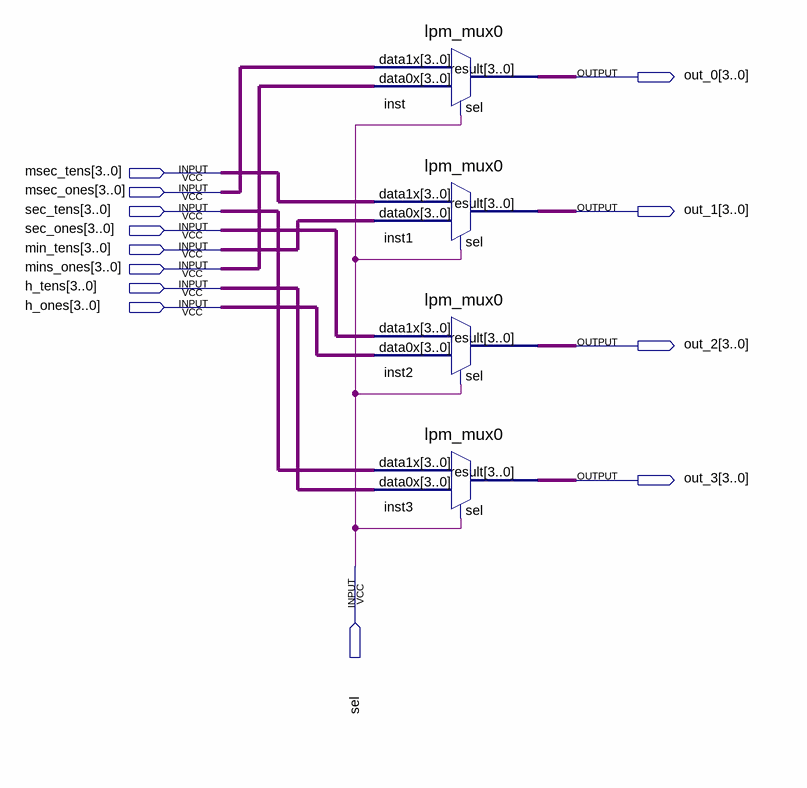
[diagram p0: schematic sheet]
// Quartus schematic time_selector.bdf as structural Verilog: 4 symbols, 13 pins
module time_selector (
  input  [3:0] msec_tens,
  input  [3:0] msec_ones,
  input  [3:0] sec_tens,
  input  [3:0] sec_ones,
  input  [3:0] min_tens,
  input  [3:0] mins_ones,
  input  [3:0] h_tens,
  input  [3:0] h_ones,
  input  sel,
  output [3:0] out_0,
  output [3:0] out_1,
  output [3:0] out_2,
  output [3:0] out_3
);

  lpm_mux0 inst (.data1x(msec_ones), .data0x(mins_ones), .sel(sel), .result(out_0));
  lpm_mux0 inst1 (.data1x(msec_tens), .data0x(min_tens), .sel(sel), .result(out_1));
  lpm_mux0 inst2 (.data1x(sec_ones), .data0x(h_ones), .sel(sel), .result(out_2));
  lpm_mux0 inst3 (.data1x(sec_tens), .data0x(h_tens), .sel(sel), .result(out_3));
endmodule
